# EAGLE design opendtu V2 (EAGLE 7.7.0)
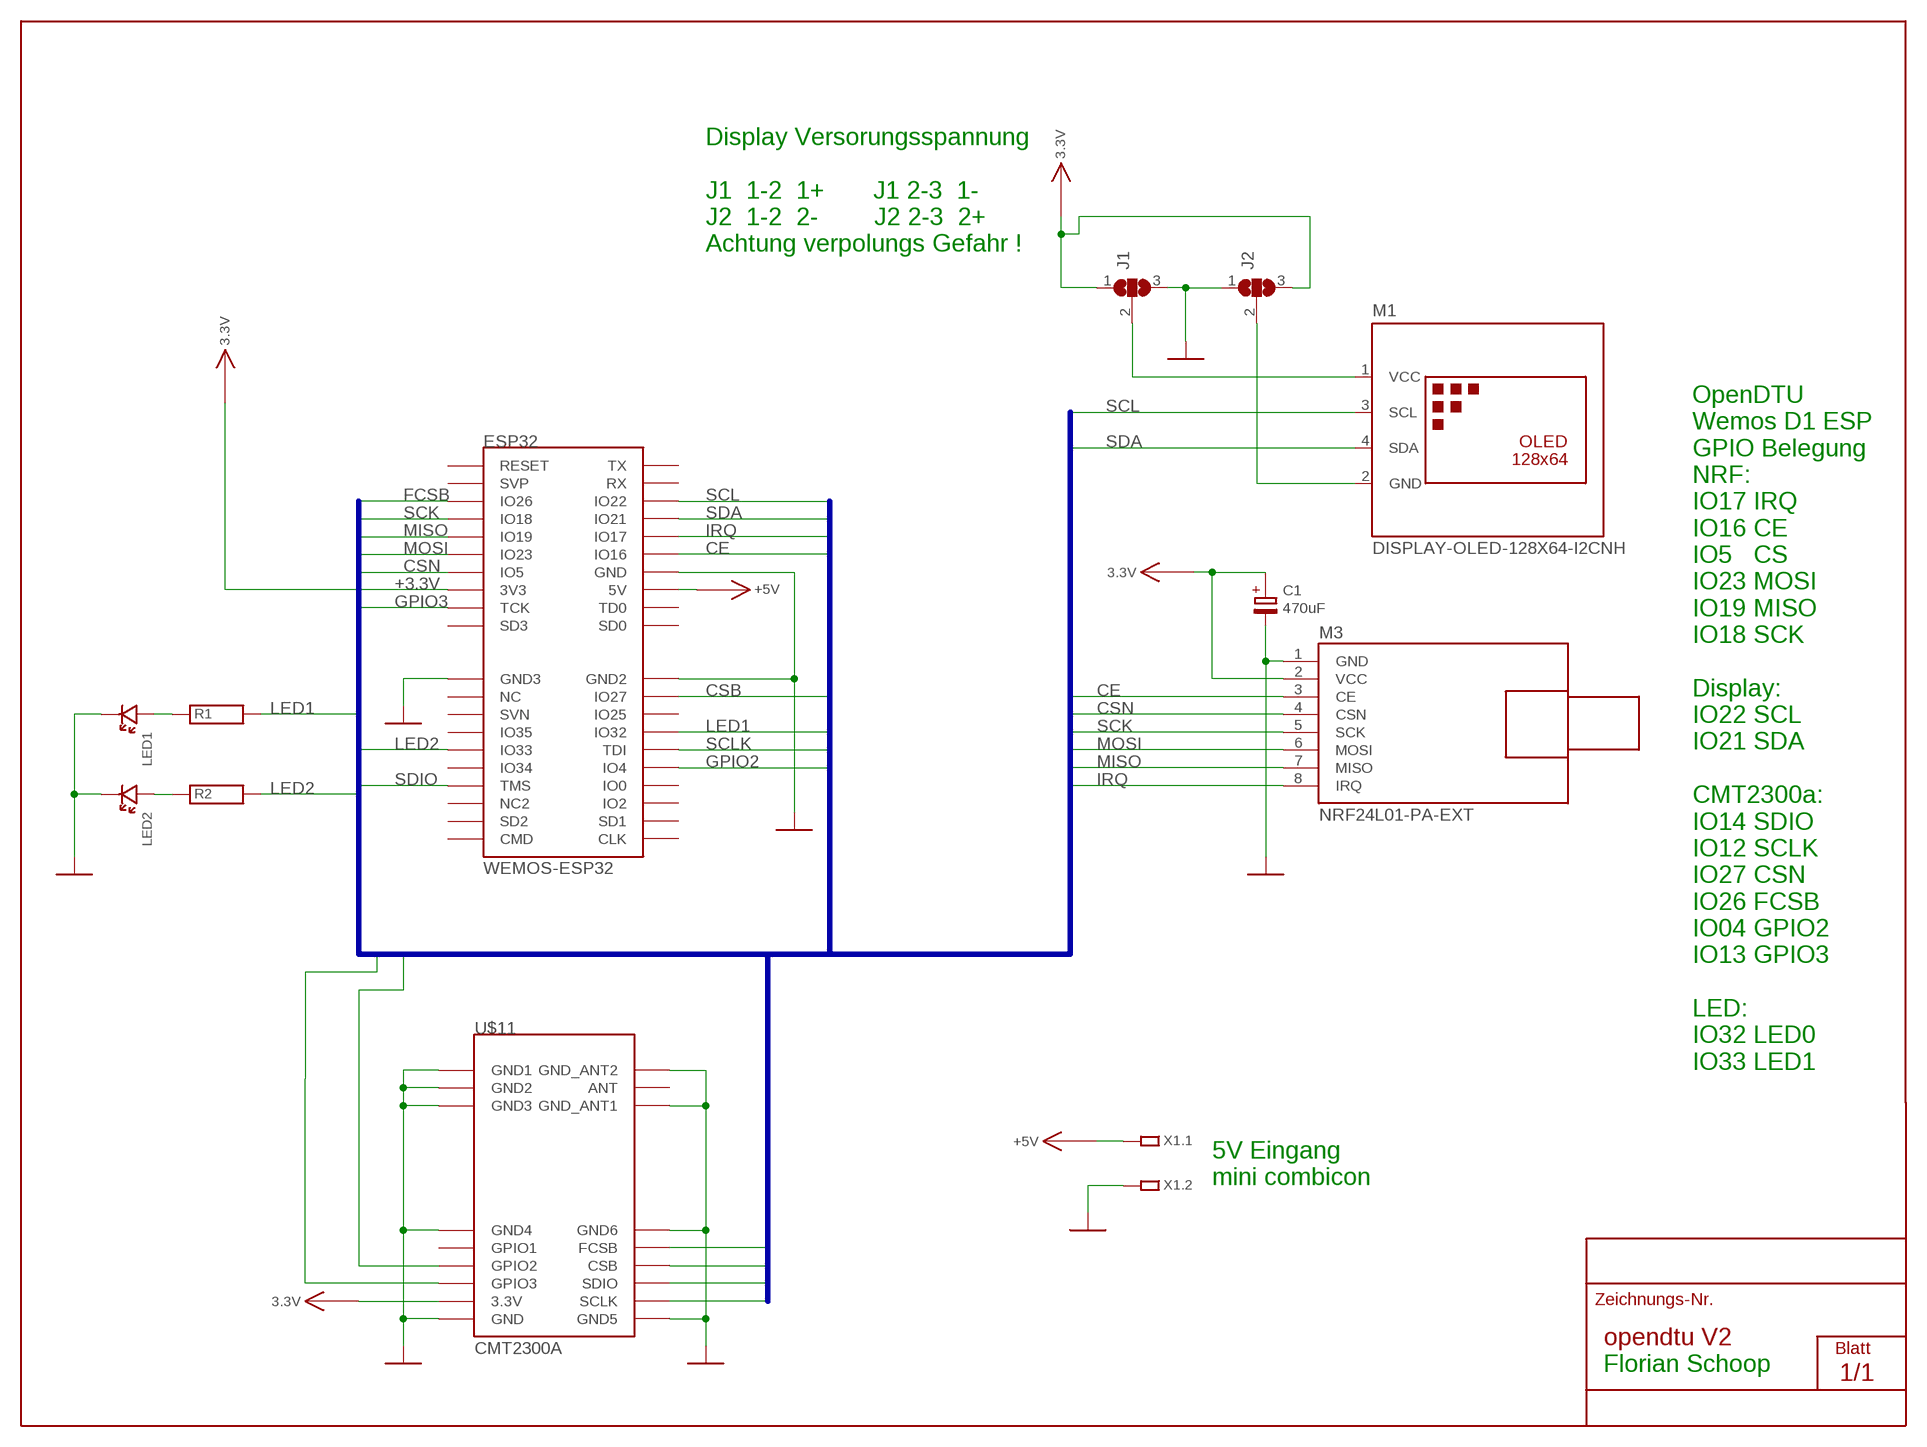
[diagram p0: schematic, sheet 1]

## Parts
C1  470uF  S470µ/16  [EB10D]
ESP32  WEMOS-ESP32  [WEMOS-ESP32]
J1  SJ2W  [SJ_2]
J2  SJ2W  [SJ_2]
LED1  LED3MM  [LED3MM]
LED2  LED3MM  [LED3MM]
M1  DISPLAY-OLED-128X64-I2CNH  [DISPLAY-OLED-128X64-I2C_NH]
M3  NRF24L01-PA-EXT  [NRF24L01-PA-EXT]
R1  WIDERSAND  [1/8W]
R2  WIDERSAND  [1/8W]
U$11  CMT2300A  [CMT2300A]
X1  MCV1,5/2G  [MCV1,5/2]

## Nets
+3.3V: C1.+ ESP32.3V3 J1.1 J2.3 M3.2(VCC) U$11.3.3V ; supply symbol labelled 3.3V
+5V: ESP32.VCC(5V) X1.1
CE: ESP32.IO16 M3.3(CE)
CSB: ESP32.IO27 U$11.CSB
CSN: ESP32.IO5 M3.4(CSN)
FCSB: ESP32.IO26 U$11.FCSB
GND: C1.- ESP32.GND ESP32.GND2 ESP32.GND3 J1.3 J2.1 LED1.K(KAT) LED2.K(KAT) M3.1(GND) U$11.GND U$11.GND1 U$11.GND2 U$11.GND3 U$11.GND4 U$11.GND5 U$11.GND6 U$11.GND_ANT1 U$11.GND_ANT2 X1.2
GPIO2: ESP32.IO4 U$11.GPIO2
GPIO3: ESP32.TCK U$11.GPIO3
IRQ: ESP32.IO17 M3.8(IRQ)
LED1: ESP32.IO32 R1.2
LED2: ESP32.IO33 R2.2
MISO: ESP32.IO19 M3.7(MISO)
MOSI: ESP32.IO23 M3.6(MOSI)
N$3: J2.2 M1.2(GND)
N$4: J1.2 M1.1(VCC)
N$5: LED2.A(ANO) R2.1
N$6: LED1.A(ANO) R1.1
SCK: ESP32.IO18 M3.5(SCK)
SCL: ESP32.IO22 M1.3(SCL)
SCLK: ESP32.TDI U$11.SCLK
SDA: ESP32.IO21 M1.4(SDA)
SDIO: ESP32.TMS U$11.SDIO
Unconnected: ESP32.CLK ESP32.CMD ESP32.IO0 ESP32.IO2 ESP32.IO25 ESP32.IO34 ESP32.IO35 ESP32.NC ESP32.NC1(NC2) ESP32.RST(RESET) ESP32.RXD(RX) ESP32.SD0 ESP32.SD1 ESP32.SD2 ESP32.SD3 ESP32.SVN ESP32.SVP ESP32.TD0 ESP32.TXD(TX) U$11.ANT U$11.GPIO1

## Buses
B$1

## Notes on the sheet
- Display Versorungsspannung
  
  J1  1-2  1+       J1 2-3  1-
  J2  1-2  2-        J2 2-3  2+
  Achtung verpolungs Gefahr !
- OpenDTU 
  Wemos D1 ESP
  GPIO Belegung
  NRF:
  IO17 IRQ
  IO16 CE
  IO5   CS
  IO23 MOSI
  IO19 MISO
  IO18 SCK
  
  Display:
  IO22 SCL
  IO21 SDA
  
  CMT2300a:
  IO14 SDIO
  IO12 SCLK
  IO27 CSN
  IO26 FCSB
  IO04 GPIO2
  IO13 GPIO3
  
  LED:
  IO32 LED0
  IO33 LED1
- 5V Eingang
  mini combicon
- Florian Schoop

## Library data of the parts
C1 = 5elko:S470µ/16
ESP32 = wemos d1:WEMOS-ESP32
J1 J2 = jumper_fs:SJ2W: SMD solder JUMPER
LED1 LED2 = LED:LED3MM
M1 = EYR_Displays:DISPLAY-OLED-128X64-I2C: 128x64 Dot Matrix OLED Module based on SSD1306 chip Variant with I2C interface
M3 = EYR_Modulos:NRF24L01-PA-EXT: 2.4 GHz Wireless Module based on NRF24L01 chip with preamplifier and external antenna
R1 R2 = 1WIDER:WIDERSAND
U$11 = cmt2300a:CMT2300A
X1 = STECKER:MCV1,5/2G

## Board
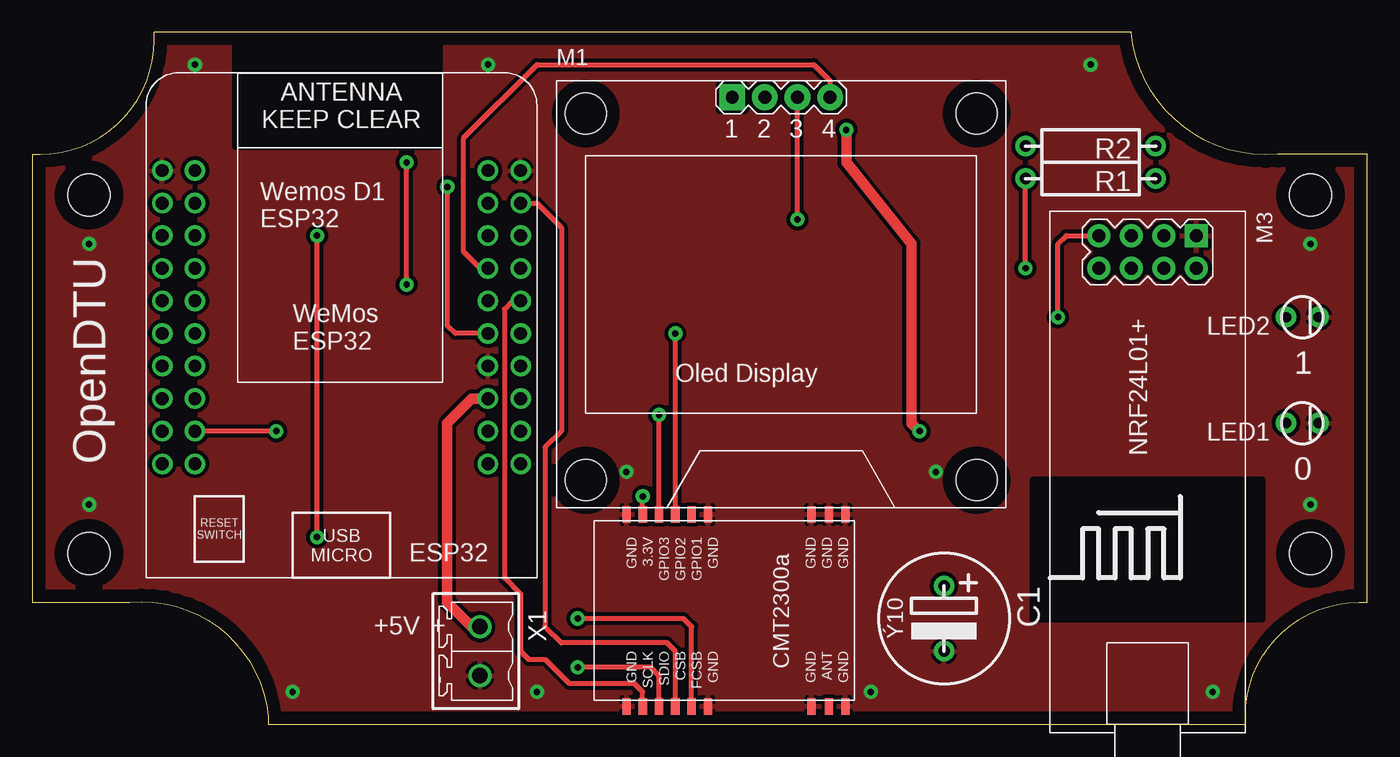
[diagram p1: board, top side]
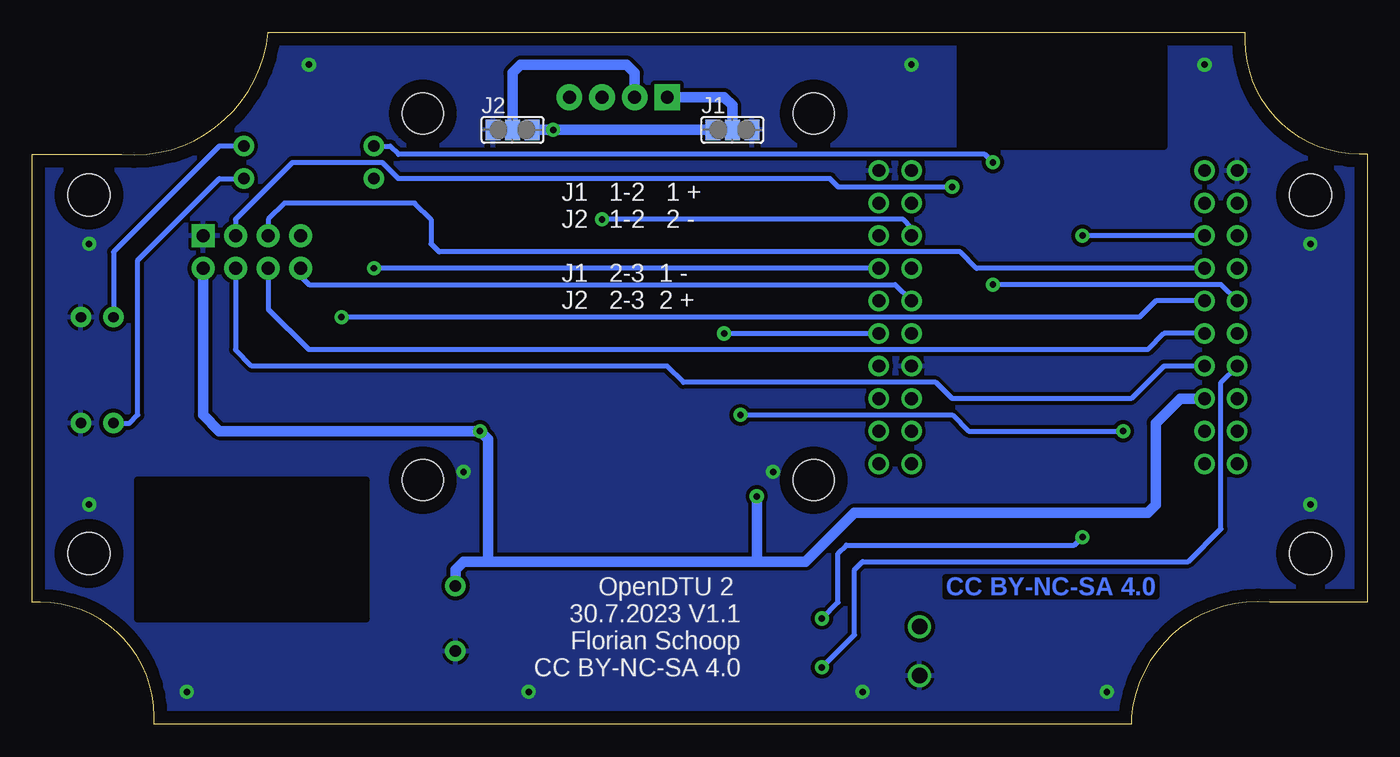
[diagram p2: board, bottom side, seen from below]

Size 104.14 x 53.98 mm. Coordinates in mm from the lower left corner, seen from the top.
Outline: 104.14,9.53 104.14,44.45 97.16,44.45 arc-90 85.72,53.98 9.53,53.98 9.53,53.34 arc-90 0.64,44.45 0,44.45 0,9.53 7.62,9.53 arc-90 18.41,0.64 18.41,0 94.61,0 94.61,0.64 arc-90 103.5,9.53 104.14,9.53
Copper layers (1*16): Component 0.035mm / dielectric 1.5mm / Solder 0.035mm
Design rules "default": minimum track width 10mil, minimum drill 0.6mm, track to track 8mil, track to pad 8mil, pad to pad 8mil, via to via 8mil, smd to smd 8mil, copper to edge 40mil, drill to drill 8mil, minimum pad ring 10mil, minimum via ring 8mil, stop-mask expansion 4mil, vias tented up to drill 0mil, thermal gap 10mil
Holes 3.3 mm at 4.45,41.27 4.45,13.34 99.69,41.27 99.69,13.34
Holes 3.2 mm at 43.18,47.62 73.66,47.62 73.66,19.05 43.18,19.05
tRestrict: area 15.9,45.1 to 31.7,54; area 78.1,8.3 to 95.9,19
bRestrict: area 15.9,45.1 to 31.7,54; area 78.1,8.3 to 95.9,19

### Footprints (pad centres in the part's own frame; a part is rotated, then mirrored left to right if it is on the bottom)
EB10D = drill 0.9 pad 1.6: + -2.54,0; - 2.54,0
WEMOS-ESP32 = drill 1 pad 1.6: 3V3 2.54,11.43; CLK 27.94,6.35; CMD 0,6.35; GND 25.4,13.97; GND2 27.94,29.21; GND3 0,29.21; IO0 27.94,13.97; IO2 27.94,11.43; IO4 27.94,16.51; IO5 2.54,13.97; IO16 25.4,16.51; IO17 25.4,19.05; IO18 2.54,21.59; IO19 2.54,19.05; IO21 25.4,21.59; IO22 25.4,24.13; IO23 2.54,16.51; IO25 27.94,24.13; IO26 2.54,24.13; IO27 27.94,26.67; IO32 27.94,21.59; IO33 0,19.05; IO34 0,16.51; IO35 0,21.59; NC 0,26.67; NC1 0,11.43; RST 2.54,29.21; RXD 25.4,26.67; SD0 25.4,6.35; SD1 27.94,8.89; SD2 0,8.89; SD3 2.54,6.35; SVN 0,24.13; SVP 2.54,26.67; TCK 2.54,8.89; TD0 25.4,8.89; TDI 27.94,19.05; TMS 0,13.97; TXD 25.4,29.21; VCC 25.4,11.43
SJ_2 = smd 1.168 x 1.6: 1 -1.524,0; 2 0,0; 3 1.524,0
LED3MM = drill 0.8 pad 1.6: A 1.27,0; K -1.27,0
DISPLAY-OLED-128X64-I2C_NH = drill 1 pad 2 square: 1 -3.81,12.7 | drill 1 pad 2: 2 -1.27,12.7; 3 1.27,12.7; 4 3.81,12.7
NRF24L01-PA-EXT = drill 1 pad 1.778 square: 1 -18.415,3.81 | drill 1.016 pad 1.778: 2 -15.875,3.81; 3 -18.415,1.27; 4 -15.875,1.27; 5 -18.415,-1.27; 6 -15.875,-1.27; 7 -18.415,-3.81; 8 -15.875,-3.81
1/8W = drill 0.9 pad 1.6: 1 0,0; 2 10.16,0
CMT2300A = smd 1.27 x 0.635: 3.3V -0.5,2.54; ANT 14.47,17.07; CSB 14.47,5.08; FCSB 14.47,6.35; GND -0.5,1.27; GND1 -0.5,18.34; GND2 -0.5,17.07; GND3 -0.5,15.7; GND4 -0.5,7.62; GND5 14.47,1.27; GND6 14.47,7.62; GND_ANT1 14.47,15.7; GND_ANT2 14.47,18.34; GPIO1 -0.5,6.35; GPIO2 -0.5,5.08; GPIO3 -0.5,3.81; SCLK 14.47,2.54; SDIO 14.47,3.81
MCV1,5/2 = drill 1.2 pad 1.6: 1 0,0; 2 3.81,0

### Placement (x,y rotation side)
C1  71.12,8.26 270 top
ESP32  10.16,13.97 0 top
J1  49.53,46.36 0 bottom
J2  66.67,46.36 0 bottom
LED1  99.06,23.49 180 top
LED2  99.06,31.75 180 top
M1  58.42,36.2 0 top
M3  86.99,19.68 270 top
R1  87.63,42.55 180 top
R2  87.63,45.09 180 top
U$11  45.09,15.88 270 top
X1  34.93,7.62 270 top

### Tracks (layer width: path | path; a pad name or v marks a point on that pad's centre or on a via)
+3.3V  (via drill 0.5 pad 1.1)
  Component 0.406: U$11.3.3V v47.62,17.78
  Component 0.813: v69.21,22.86 68.58,23.49 68.58,37.47 63.5,43.82 v63.5,46.36
  Solder 0.406: 65.41,46.36 J2.3
  Solder 0.813: J1.1 v63.5,46.36 J2.3 | ESP32.3V3 14.61,25.4 16.51,23.49 16.51,17.14 17.14,16.51 40.01,16.51 43.82,12.7 47.62,12.7 | 68.58,12.7 68.58,22.22 v69.21,22.86 89.53,22.86 90.8,24.13 M3.2 | v47.62,17.78 47.62,12.7 | 47.62,12.7 68.58,12.7 | 68.58,12.7 70.48,12.7 71.12,12.06 C1.+
+5V
  Component 0.813: X1.1 34.29,7.62 32.39,9.53 32.39,23.49 34.29,25.4 ESP32.VCC
CE  (via drill 0.5 pad 1.1)
  Component 0.406: v32.39,41.91 32.39,31.11 33.02,30.48 ESP32.IO16
  Solder 0.406: v32.39,41.91 41.27,41.91 41.91,42.55 75.56,42.55 76.83,43.82 83.82,43.82 88.27,39.37 M3.3
CSB
  Component 0.406: ESP32.IO27 39.37,40.64 41.27,38.73 41.27,22.86 40.01,21.59 40.01,7.62 41.27,6.35 49.53,6.35 50.16,5.71 U$11.CSB
CSN
  Solder 0.406: ESP32.IO5 15.88,27.94 18.41,25.4 32.39,25.4 33.66,26.67 53.34,26.67 54.61,27.94 86.99,27.94 88.27,29.21 M3.4
FCSB  (via drill 0.5 pad 1.1)
  Component 0.406: U$11.FCSB 51.44,7.62 50.8,8.26 v42.55,8.26 | v22.22,14.61 v22.22,38.1
  Solder 0.406: v42.55,8.26 41.27,9.53 41.27,13.34 40.64,13.97 22.86,13.97 v22.22,14.61 | ESP32.IO26 v22.22,38.1
GND  (via drill 0.5 pad 1.1)
  other vias: 46.36,19.68 70.48,19.68 12.7,51.44 82.55,51.44 20.32,2.54 92.07,2.54 4.45,17.14 4.45,37.47 35.56,51.44 99.69,37.47 99.69,17.14 65.41,2.54 39.37,2.54
  pour Component (isolate 0.3): 9.53,53.98 85.72,53.98 arc90 95.25,44.45 96.52,44.45 104.14,44.45 104.14,31.75 104.14,9.53 arc90 94.61,0 73.02,0 18.41,0 arc90 8.89,9.53 5.08,9.53 0,9.53 0,12.06 0,44.45 arc90
  pour Solder (isolate 0.3): 9.53,53.98 85.72,53.98 arc90 95.25,44.45 104.14,44.45 104.14,9.53 arc90 94.61,0 59.05,0 18.41,0 arc90 8.89,9.53 0,9.53 0,26.04 0,44.45 arc90
GPIO2  (via drill 0.5 pad 1.1)
  Component 0.406: U$11.GPIO2 v50.16,30.48
  Solder 0.406: v50.16,30.48 ESP32.IO4
GPIO3  (via drill 0.5 pad 1.1)
  Component 0.406: U$11.GPIO3 v48.9,24.13 | v19.05,22.86 ESP32.TCK
  Solder 0.406: v48.9,24.13 32.39,24.13 31.11,22.86 v19.05,22.86
IRQ
  Solder 0.406: ESP32.IO17 36.83,34.29 82.55,34.29 83.18,34.93 M3.8
LED1  (via drill 0.5 pad 1.1)
  Component 0.406: v77.47,35.56 R1.2
  Solder 0.406: ESP32.IO32 v77.47,35.56
LED2  (via drill 0.5 pad 1.1)
  Component 0.406: v29.21,34.29 v29.21,43.82
  Solder 0.406: ESP32.IO33 11.43,34.29 v29.21,34.29 | v29.21,43.82 29.84,44.45 75.56,44.45 76.2,45.09 R2.2
MISO  (via drill 0.5 pad 1.1)
  Component 0.406: v80.01,31.75 80.01,37.47 80.64,38.1 M3.7
  Solder 0.406: ESP32.IO19 16.51,33.02 17.78,31.75 v80.01,31.75
MOSI
  Solder 0.406: ESP32.IO23 15.88,30.48 17.14,29.21 82.55,29.21 85.72,32.39 M3.6
N$3
  Solder 0.813: M1.2 57.15,50.8 57.79,51.44 66.04,51.44 66.67,50.8 J2.2
N$4
  Solder 0.813: J1.2 49.53,48.26 50.16,48.9 M1.1
N$5
  Solder 0.406: R2.1 89.53,45.09 97.79,36.83 LED2.A
N$6
  Solder 0.406: LED1.A 96.52,23.49 95.88,24.13 95.88,36.2 89.53,42.55 R1.1
SCK
  Solder 0.406: ESP32.IO18 30.48,35.56 31.75,36.83 72.39,36.83 73.02,37.47 73.02,39.37 74.3,40.64 84.45,40.64 85.72,39.37 M3.5
SCL  (via drill 0.5 pad 1.1)
  Component 0.406: v59.69,39.37 M1.3
  Solder 0.406: v59.69,39.37 36.2,39.37 35.56,38.73 ESP32.IO22
SCLK
  Component 0.406: U$11.SCLK 47.62,2.54 46.99,3.17 41.91,3.17 40.01,5.08 38.73,5.08 38.1,5.71 38.1,10.16 36.83,11.43 36.83,32.39 37.47,33.02 ESP32.TDI
SDA
  Component 0.406: ESP32.IO21 34.93,35.56 33.66,36.83 33.66,45.72 39.37,51.44 60.96,51.44 62.23,50.16 M1.4
SDIO  (via drill 0.5 pad 1.1)
  Component 0.406: U$11.SDIO 48.9,3.81 48.26,4.45 v42.55,4.45
  Solder 0.406: v42.55,4.45 40.01,6.99 40.01,12.06 39.37,12.7 13.97,12.7 11.43,15.24 11.43,26.67 ESP32.TMS

### Text on the board
Solder: CC BY-NC-SA 4.0
tNames: 1 | 2 | 3 | 4 | Wemos D1 / ESP32 | 1 | Oled Display | NRF24L01+ | OpenDTU | 0 | +5V | + | -
bNames: J1 1-2 1 + / J2 1-2 2 - / / J1 2-3 1 - / J2 2-3 2 + | OpenDTU 2 / 30.7.2023 V1.1 / Florian Schoop / CC BY-NC-SA 4.0